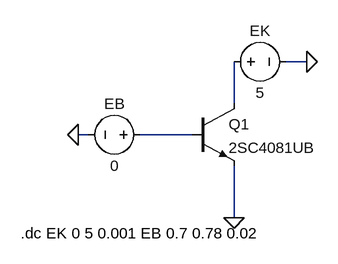
[diagram p0: schematic lab2_task2.asc]
lab2_task2.asc, the LTspice schematic file:
Version 4
SHEET 1 880 680
WIRE 304 192 272 192
WIRE 192 256 192 192
WIRE -32 304 -48 304
WIRE 128 304 48 304
WIRE 192 432 192 352
FLAG 304 192 0
FLAG -48 304 0
FLAG 192 432 0
SYMBOL npn 128 256 R0
SYMATTR InstName Q1
SYMATTR Value 2SC4081UB
SYMBOL voltage 176 192 R270
WINDOW 0 32 56 VTop 2
WINDOW 3 -32 56 VBottom 2
SYMATTR InstName EK
SYMATTR Value 5
SYMBOL voltage 64 304 R90
WINDOW 0 -32 56 VBottom 2
WINDOW 3 32 56 VTop 2
SYMATTR InstName EB
SYMATTR Value 0
TEXT -136 456 Left 2 !.dc EK 0 5 0.001 EB 0.7 0.78 0.02

The netlist it stands for:
* lab2_task2.asc
Q1 N001 N002 0 0 2SC4081UB
V§EK N001 0 5
V§EB N002 0 0
.model NPN NPN
.model PNP PNP
.lib standard.bjt
.dc EK 0 5 0.001 EB 0.7 0.78 0.02
.backanno
.end